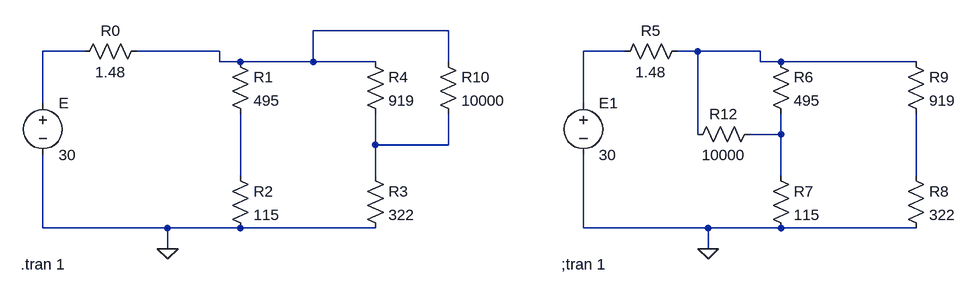
[diagram p0: schematic Draft1.asc]
Draft1.asc, the LTspice schematic file:
Version 4
SHEET 1 1536 680
WIRE 704 48 496 48
WIRE 144 80 80 80
WIRE 352 80 224 80
WIRE 976 80 912 80
WIRE 1088 80 1056 80
WIRE 1184 80 1088 80
WIRE 352 96 352 80
WIRE 384 96 352 96
WIRE 496 96 496 48
WIRE 496 96 384 96
WIRE 592 96 496 96
WIRE 704 96 704 48
WIRE 1184 96 1184 80
WIRE 1216 96 1184 96
WIRE 1424 96 1216 96
WIRE 80 160 80 80
WIRE 912 160 912 80
WIRE 1088 208 1088 80
WIRE 1216 208 1216 176
WIRE 1216 208 1168 208
WIRE 592 224 592 176
WIRE 704 224 704 176
WIRE 704 224 592 224
WIRE 384 272 384 176
WIRE 592 272 592 224
WIRE 1216 272 1216 208
WIRE 1424 272 1424 176
WIRE 80 352 80 240
WIRE 272 352 80 352
WIRE 384 352 272 352
WIRE 592 352 384 352
WIRE 912 352 912 240
WIRE 1104 352 912 352
WIRE 1216 352 1104 352
WIRE 1424 352 1216 352
WIRE 272 384 272 352
WIRE 1104 384 1104 352
FLAG 272 384 0
FLAG 1104 384 0
SYMBOL voltage 80 144 R0
SYMATTR InstName E
SYMATTR Value 30
SYMBOL res 240 64 R90
WINDOW 0 0 56 VBottom 2
WINDOW 3 32 56 VTop 2
SYMATTR InstName R0
SYMATTR Value 1.48
SYMBOL res 368 80 R0
SYMATTR InstName R1
SYMATTR Value 495
SYMBOL res 368 256 R0
SYMATTR InstName R2
SYMATTR Value 115
SYMBOL res 576 256 R0
SYMATTR InstName R3
SYMATTR Value 322
SYMBOL res 576 80 R0
SYMATTR InstName R4
SYMATTR Value 919
SYMBOL voltage 912 144 R0
SYMATTR InstName E1
SYMATTR Value 30
SYMBOL res 1072 64 R90
WINDOW 0 0 56 VBottom 2
WINDOW 3 32 56 VTop 2
SYMATTR InstName R5
SYMATTR Value 1.48
SYMBOL res 1200 80 R0
SYMATTR InstName R6
SYMATTR Value 495
SYMBOL res 1200 256 R0
SYMATTR InstName R7
SYMATTR Value 115
SYMBOL res 1408 256 R0
SYMATTR InstName R8
SYMATTR Value 322
SYMBOL res 1408 80 R0
SYMATTR InstName R9
SYMATTR Value 919
SYMBOL res 688 80 R0
SYMATTR InstName R10
SYMATTR Value 10000
SYMBOL res 1184 192 R90
WINDOW 0 0 56 VBottom 2
WINDOW 3 32 56 VTop 2
SYMATTR InstName R12
SYMATTR Value 10000
TEXT 46 408 Left 2 !.tran 1
TEXT 878 408 Left 2 !;tran 1

The netlist it stands for:
* Draft1.asc
V§E N002 0 30
R0 N001 N002 1.48
R1 N001 N007 495
R2 N007 0 115
R3 N006 0 322
R4 N001 N006 919
V§E1 N003 0 30
R5 N004 N003 1.48
R6 N004 N005 495
R7 N005 0 115
R8 N008 0 322
R9 N004 N008 919
R10 N001 N006 10000
R12 N005 N004 10000
.tran 1
;tran 1
.backanno
.end